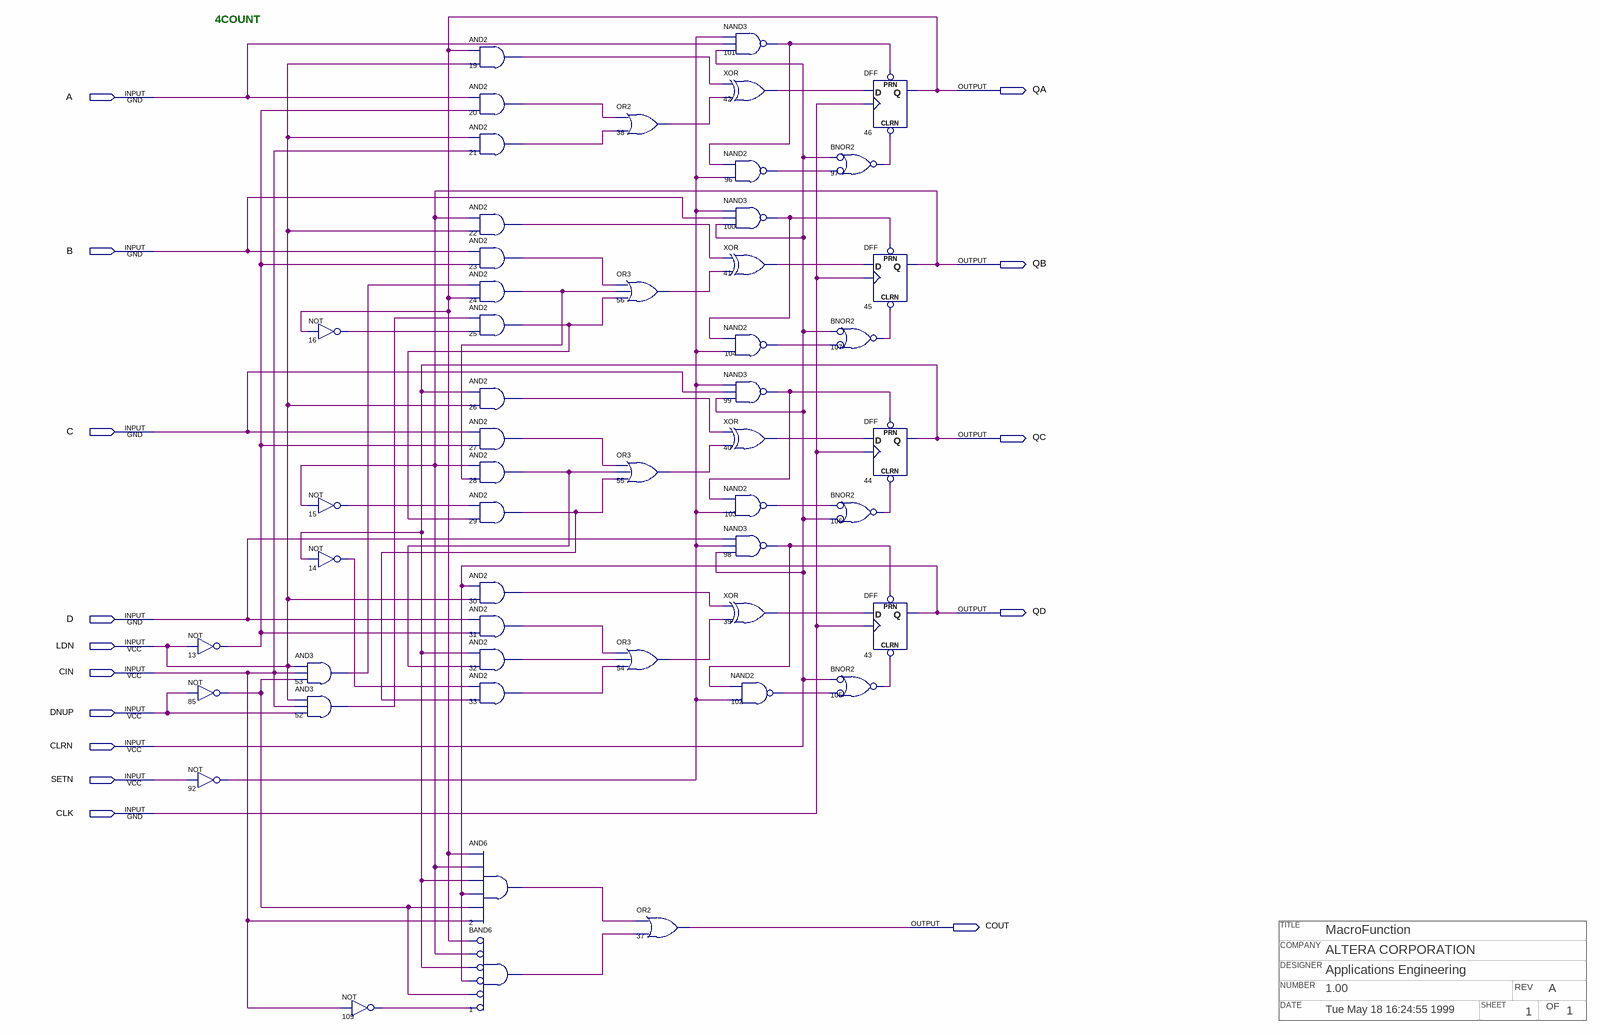
[diagram p0: schematic sheet]
// Quartus schematic 4count.bdf as structural Verilog: 51 symbols, 15 pins
// Title block: TITLE: MacroFunction; COMPANY: ALTERA CORPORATION; DESIGNER: Applications Engineering; NUMBER: 1.00; REV: A; DATE: Tue May 18 16:24:55 1999; SHEET: 1; OF: 1
module \4count  (
  input  A,
  input  B,
  input  C,
  input  D,
  input  LDN,
  input  CIN,
  input  DNUP,
  input  CLRN,
  input  SETN,
  input  CLK,
  output QA,
  output QB,
  output QC,
  output QD,
  output COUT
);

  wire n1_out, n2_out, n13_out, n14_out, n15_out, n16_out, n19_out, n20_out, n21_out, n22_out, n23_out,
       n24_out, n25_out, n26_out, n27_out, n28_out, n29_out, n30_out, n31_out, n32_out, n33_out, n38_out,
       n39_out, n40_out, n41_out, n42_out, n52_out, n53_out, n54_out, n55_out, n56_out, n85_out, n92_out,
       n96_out, n97_out, n98_out, n99_out, n100_out, n101_out, n102_out, n103_out, n104_out, n105_out,
       n106_out, n107_out, n109_out;

  not u_13 (n13_out, LDN);
  not u_85 (n85_out, DNUP);
  not u_92 (n92_out, SETN);
  not u_16 (n16_out, QA);
  not u_15 (n15_out, QB);
  not u_14 (n14_out, QC);
  and u_53 (n53_out, LDN, CIN, n85_out);
  and u_52 (n52_out, LDN, CIN, DNUP);
  not u_109 (n109_out, CIN);
  and u_19 (n19_out, QA, LDN);
  and u_20 (n20_out, A, n13_out);
  and u_21 (n21_out, LDN, CIN);
  and u_22 (n22_out, QB, LDN);
  and u_23 (n23_out, B, n13_out);
  and u_24 (n24_out, n53_out, QA);
  and u_25 (n25_out, n52_out, n16_out);
  and u_26 (n26_out, QC, LDN);
  and u_27 (n27_out, C, n13_out);
  and u_28 (n28_out, QB, n24_out);
  and u_29 (n29_out, n15_out, n25_out);
  and u_30 (n30_out, QD, LDN);
  and u_31 (n31_out, D, n13_out);
  and u_32 (n32_out, QC, n28_out);
  and u_33 (n33_out, n14_out, n29_out);
  and u_2 (n2_out, QA, QB, QC, QD, n85_out, CIN);
  and u_1 (n1_out, ~QA, ~QB, ~QC, ~QD, ~n85_out, ~n109_out);  // BAND6
  or u_38 (n38_out, n20_out, n21_out);
  or u_56 (n56_out, n23_out, n24_out, n25_out);
  or u_55 (n55_out, n27_out, n28_out, n29_out);
  or u_54 (n54_out, n31_out, n32_out, n33_out);
  or u_37 (COUT, n2_out, n1_out);
  nand u_101 (n101_out, n92_out, A, CLRN);
  xor u_42 (n42_out, n19_out, n38_out);
  nand u_96 (n96_out, n101_out, n92_out);
  nand u_100 (n100_out, n92_out, B, CLRN);
  xor u_41 (n41_out, n22_out, n56_out);
  nand u_104 (n104_out, n100_out, n92_out);
  nand u_99 (n99_out, n92_out, C, CLRN);
  xor u_40 (n40_out, n26_out, n55_out);
  nand u_103 (n103_out, n99_out, n92_out);
  nand u_98 (n98_out, D, n92_out, CLRN);
  xor u_39 (n39_out, n30_out, n54_out);
  nand u_102 (n102_out, n98_out, n92_out);
  nor u_97 (n97_out, ~CLRN, ~n96_out);  // BNOR2
  nor u_107 (n107_out, ~CLRN, ~n104_out);  // BNOR2
  nor u_106 (n106_out, ~n103_out, ~CLRN);  // BNOR2
  nor u_105 (n105_out, ~CLRN, ~n102_out);  // BNOR2
  DFF u_46 (.CLRN(n97_out), .CLK(CLK), .D(n42_out), .PRN(n101_out), .Q(QA));
  DFF u_45 (.CLRN(n107_out), .CLK(CLK), .D(n41_out), .PRN(n100_out), .Q(QB));
  DFF u_44 (.CLRN(n106_out), .CLK(CLK), .D(n40_out), .PRN(n99_out), .Q(QC));
  DFF u_43 (.CLRN(n105_out), .CLK(CLK), .D(n39_out), .PRN(n98_out), .Q(QD));

  // Notes on the sheet:
  //   4COUNT
endmodule
